# Altium schematic sheet STM.SchDoc
size A4; SheetNumber: 1; SheetTotal: 2
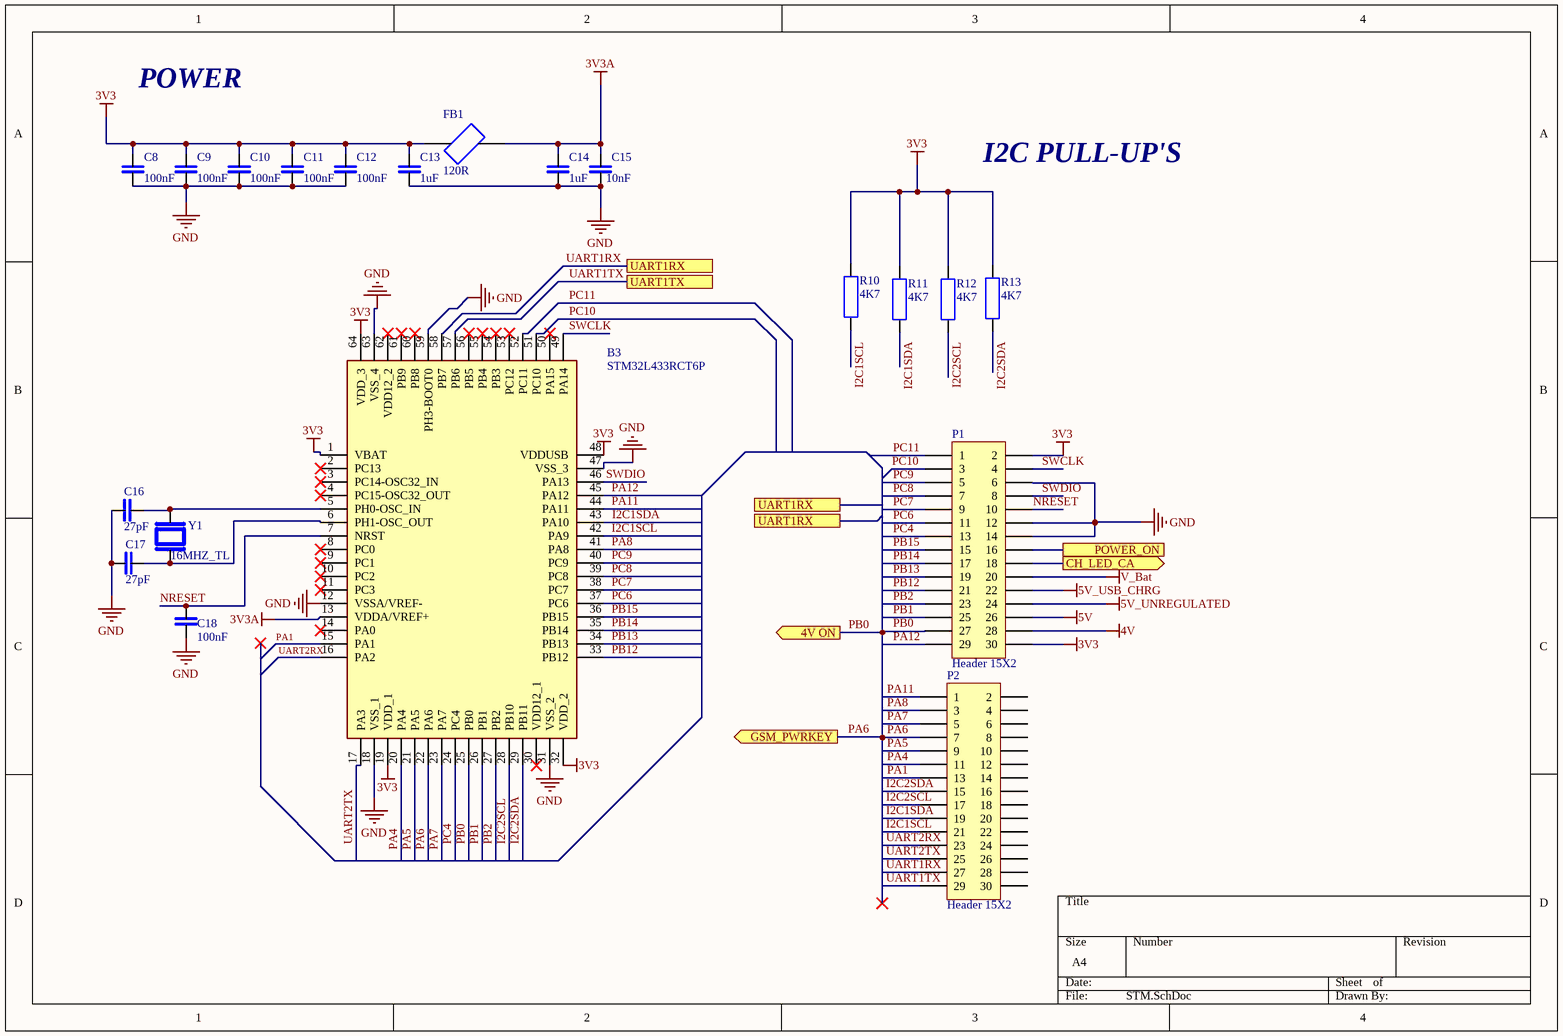
[diagram p0: STM.SchDoc]

## Parts
B3  STM32L433RCT6P  [STM32L433RCT6P]
C8  100nF  [CAP_0805]
C9  100nF  [CAP_0805]
C10  100nF  [CAP_0805]
C11  100nF  [CAP_0805]
C12  100nF  [CAP_0805]
C13  1uF  [CAP_0805]
C14  1uF  [CAP_0805]
C15  10nF  [CAP_0805]
C16  27pF  [CAP_0805]
C17  27pF  [CAP_0805]
C18  100nF  [CAP_0805]
FB1  120R  [FER_BEAD_0805]
P1  Header 15X2  [HDR2X15]
P2  Header 15X2  [HDR2X15]
R10  4K7  [RES_0805]
R11  4K7  [RES_0805]
R12  4K7  [RES_0805]
R13  4K7  [RES_0805]
Y1  16MHZ_TL  [16MHZ_TL]

## Ports
4V ON (out), CH_LED_CA (out), GSM_PWRKEY (out), POWER_ON, UART1RX, UART1TX

## Nets
3V3: B3.1(VBAT) B3.19(VDD_1) B3.32(VDD_2) B3.48(VDDUSB) B3.64(VDD_3) C8.2 C9.2 C10.2 C11.2 C12.2 C13.2 FB1.1 P1.2 P1.30 R10.2 R11.2 R12.2 R13.2
3V3A: B3.13(VDDA/VREF+) C14.2 C15.2 FB1.2
4V: P1.28
5V: P1.26
5V_UNREGULATED: P1.24
5V_USB_CHRG: P1.22
GND: B3.12(VSSA/VREF-) B3.18(VSS_1) B3.31(VSS_2) B3.47(VSS_3) B3.59(PH3-BOOT0) B3.63(VSS_4) C8.1 C9.1 C10.1 C11.1 C12.1 C13.1 C14.1 C15.1 C16.2 C17.1 C18.1 P1.6 P1.12 P1.14
V_Bat: P1.20
CH_LED_CA: P1.18 ; port CH_LED_CA
I2C1SCL: B3.42(PA9) P2.21 R10.1
I2C1SDA: B3.43(PA10) P2.19 R11.1
I2C2SCL: B3.28(PB10) P2.17 R12.1
I2C2SDA: B3.29(PB11) P2.15 R13.1
NRESET: B3.7(NRST) C18.2 P1.10
PA1: B3.15(PA1) P2.13
PA4: B3.20(PA4) P2.11
PA5: B3.21(PA5) P2.9
PA6: B3.22(PA6) P2.7 ; port GSM_PWRKEY
PA7: B3.23(PA7) P2.5
PA8: B3.41(PA8) P2.3
PA11: B3.44(PA11) P2.1
PA12: B3.25(PB0) B3.45(PA12) P1.27 P1.29 ; port 4V ON  [also labelled PB0]
PB1: B3.26(PB1) P1.25
PB2: B3.27(PB2) P1.23
PB12: B3.33(PB12) P1.21
PB13: B3.34(PB13) P1.19
PB14: B3.35(PB14) P1.17
PB15: B3.36(PB15) P1.15
PC4: B3.24(PC4) P1.13
PC6: B3.37(PC6) P1.11
PC7: B3.38(PC7) P1.9
PC8: B3.39(PC8) P1.7
PC9: B3.40(PC9) P1.5
PC10: B3.51(PC10) P1.3
PC11: B3.52(PC11) P1.1
POWER_ON: P1.16 ; port POWER_ON
SWCLK: B3.49(PA14) P1.4
SWDIO: B3.46(PA13) P1.8
UART1RX: B3.58(PB7) P2.27 ; port UART1RX
UART1TX: B3.57(PB6) P2.29 ; port UART1TX
UART2RX: B3.16(PA2) P2.23
UART2TX: B3.17(PA3) P2.25
NetB3_5: B3.5(PH0-OSC_IN) C16.1 Y1.2
NetB3_6: B3.6(PH1-OSC_OUT) C17.2 Y1.1

Not connected (* = marked no-connect by the designer): B3 2(PC13)* 3(PC14-OSC32_IN)* 4(PC15-OSC32_OUT)* 8(PC0)* 9(PC1)* 10(PC2)* 11(PC3)* 14(PA0)* 30(VDD12_1)* 50(PA15)* 53(PC12)* 54(PB3)* 55(PB4)* 56(PB5)* 60(PB8)* 61(PB9)* 62(VDD12_2)*; P2 2 4 6 8 10 12 14 16 18 20 22 24 26 28 30

## Notes on the sheet
- POWER
- I2C PULL-UP'S
- Labels drawn without touching a wire or pin: PB0

## Library data of the parts
B3 = STM32L433RCT6P: ARM Cortex-M4 MCU 80 MHz with 256 Kbyte; Manufacturer_Name: STMicroelectronics; Geometry.Height: 1.6mm; Manufacturer_Part_Number: STM32L433RCT6P; Mouser Part Number: 511-STM32L433RCT6P; Mouser Price/Stock: https://www.mouser.co.uk/ProductDetail/STMicroelectronics/STM32L433RCT6P?qs=5aG0NVq1C4w37CrDvhaloQ%3D%3D; Arrow Part Number: STM32L433RCT6P; Arrow Price/Stock: https://www.arrow.com/en/products/stm32l433rct6p/stmicroelectronics?region=nac; Datasheet Link: https://www.mouser.com/datasheet/2/389/stm32l433cc-956250.pdf
C8-C18 = SMT_CAP: MP: LD051A270KAB2A; Package: None; Price: None; Availability: Unavailable
FB1 = SMT_FER_BEAD: 1 kOhms @ 100MHz 1 1.5A 150mOhm; MF: TDK; MP: MPZ2012S102ATD25; Check_prices: https://www.snapeda.com/parts/MPZ2012S102ATD25/TDK/view-part/2724083/?ref=eda; Availability: Good; Price: None; SnapEDA_Link: https://www.snapeda.com/parts/MPZ2012S102ATD25/TDK/view-part/2724083/?ref=snap; Value: *; Package: 0805 TDK; Purchase-URL: https://pricing.snapeda.com/search/part/MPZ2012S102ATD25/?ref=eda
P1 P2 = Header 15X2: Header, 15-Pin, Dual row; LatestRevisionDate: 17-Jul-2002; LatestRevisionNote: Re-released for DXP Platform.; Publisher: Altium Limited
R10-R13 = SMT_RES: Power_Rating: .25 W; MP: 2-2176053-0; Tolerance: 1%; Resistance: .33; MF: TE Connectivity; Price: None; Availability: In Stock; EU_RoHS_Compliance: Compliant with Exemptions; Package: 0805; Value: *; SnapEDA_Link: https://www.snapeda.com/parts/2-2176053-0/TE+Connectivity/view-part/?ref=snap; Check_prices: https://www.snapeda.com/parts/2-2176053-0/TE+Connectivity/view-part/?ref=eda
Y1 = 16MHZ_TL: 16MHz Â±30ppm Crystal 18pF 40 Ohms HC-49/US; MF: Abracon LLC; MP: ABL-16.000MHz-B4Y; Package: HC-49/US ABRACON; Price: None; Purchase-URL: https://pricing.snapeda.com/search/part/ABL-16.000MHz-B4Y/?ref=eda; Check_prices: https://www.snapeda.com/parts/ABL-16.000MHz-B4Y/Abracon+LLC/view-part/?ref=eda; Value: *; SnapEDA_Link: https://www.snapeda.com/parts/ABL-16.000MHz-B4Y/Abracon+LLC/view-part/?ref=snap; Availability: In Stock